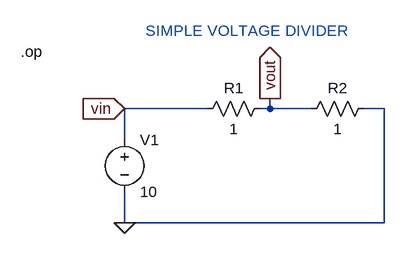
[diagram p0: schematic voltage divider.asc]
voltage divider.asc, the LTspice schematic file:
Version 4
SHEET 1 880 680
WIRE 160 112 32 112
WIRE 256 112 256 96
WIRE 256 112 240 112
WIRE 320 112 256 112
WIRE 432 112 400 112
WIRE 32 160 32 112
WIRE 32 288 32 240
WIRE 432 288 432 112
WIRE 432 288 32 288
FLAG 32 288 0
FLAG 32 112 vin
IOPIN 32 112 In
FLAG 256 96 vout
IOPIN 256 96 Out
SYMBOL res 256 96 R90
WINDOW 0 0 56 VBottom 2
WINDOW 3 32 56 VTop 2
SYMATTR InstName R1
SYMATTR Value 1
SYMBOL res 416 96 R90
WINDOW 0 0 56 VBottom 2
WINDOW 3 32 56 VTop 2
SYMATTR InstName R2
SYMATTR Value 1
SYMBOL voltage 32 144 R0
SYMATTR InstName V1
SYMATTR Value 10
TEXT 64 -8 Left 2 ;SIMPLE VOLTAGE DIVIDER
TEXT -128 24 Left 2 !.op

The netlist it stands for:
* voltage divider.asc
R1 vout vin 1
R2 0 vout 1
V1 vin 0 10
* SIMPLE VOLTAGE DIVIDER
.op
.backanno
.end